# Altium schematic sheet FastDAC.SchDoc: Fast DAC
size Letter
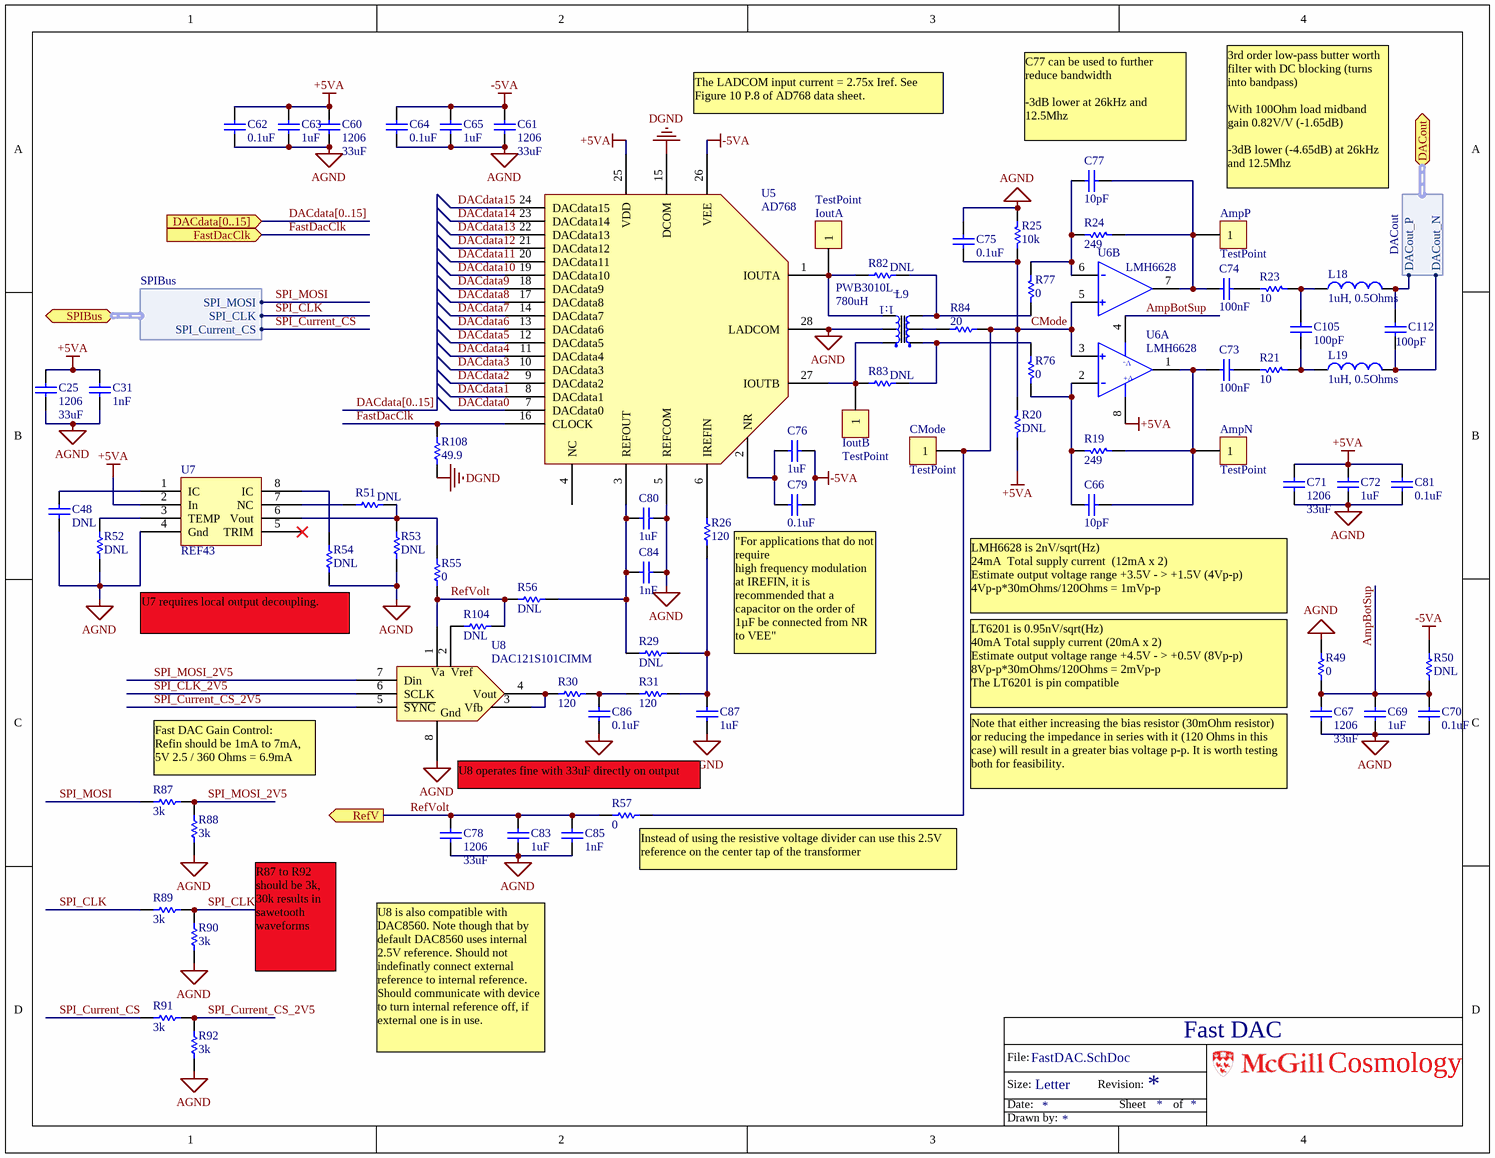
[diagram p0: FastDAC.SchDoc]

## Parts
AmpN  TestPoint  [TP-3520-SK]  (no BOM)
AmpP  TestPoint  [TP-3520-SK]  (no BOM)
C25  Footprint: 1206  [CC3225-1210]  (hidden comment: 33uF)
C31  1nF  [0603]
C48  DNL  [0603]
C60  Footprint: 1206  [CC3225-1210]  (hidden comment: 33uF)
C61  Footprint: 1206  [CC3225-1210]  (hidden comment: 33uF)
C62  0.1uF  [0603]
C63  1uF  [0603]
C64  0.1uF  [0603]
C65  1uF  [0603]
C66  10pF  [0603]
C67  Footprint: 1206  [CC3225-1210]  (hidden comment: 33uF)
C69  1uF  [0603]
C70  0.1uF  [0603]
C71  Footprint: 1206  [CC3225-1210]  (hidden comment: 33uF)
C72  1uF  [0603]
C73  100nF  [0603]
C74  100nF  [0603]
C75  0.1uF  [0603]
C76  1uF  [0603]
C77  10pF  [0603]
C78  Footprint: 1206  [CC3225-1210]  (hidden comment: 33uF)
C79  0.1uF  [0603]
C80  1uF  [0603]
C81  0.1uF  [0603]
C83  1uF  [0603]
C84  1nF  [0603]
C85  1nF  [0603]
C86  0.1uF  [0603]
C87  1uF  [0603]
C105  100pF  [0603]
C112  100pF  [0603]
CMode  TestPoint  [TP-3520-SK]  (no BOM)
IoutA  TestPoint  [TP-3520-SK]  (no BOM)
IoutB  TestPoint  [TP-3520-SK]  (no BOM)
L9  PWB3010L_  value 780uH  [PWB]
L18  1uH, 0.5Ohms  [0805]
L19  1uH, 0.5Ohms  [0805]
R19  249  [0603]
R20  DNL  [0603]
R21  10  [0603]
R23  10  [0603]
R24  249  [0603]
R25  10k  [0603]
R26  120  [0603]
R29  DNL  [0603]
R30  120  [0603]
R31  120  [0603]
R49  0  [0603]
R50  DNL  [0603]
R51  DNL  [0603]
R52  DNL  [0603]
R53  DNL  [0603]
R54  DNL  [0603]
R55  0  [0603]
R56  DNL  [0603]
R57  0  [0603]
R76  0  [0603]
R77  0  [0603]
R82  DNL  [0603]
R83  DNL  [0603]
R84  20  [0603]
R87  3k  [0603]
R88  3k  [0603]
R89  3k  [0603]
R90  3k  [0603]
R91  3k  [0603]
R92  3k  [0603]
R104  DNL  [0603]
R108  49.9  [0603]
U5  AD768  [SOIC 28 300mils]
U6  LMH6628  [SO8]  (parts A,B of 2)
U7  REF43  [SO8]
U8  DAC121S101CIMM  [MSOP-8]

## Ports
DACdata[0..15] (in), DACout (harness DACout), FastDacClk (in), RefV (out), SPIBus (harness SPIBus)

## Harnesses
DACout: DACout_N, DACout_P
SPIBus: SPI_MOSI, SPI_CLK, SPI_Current_CS

## Nets
+5VA: C25.1 C31.1 C60.2 C62.2 C63.2 C71.2 C72.1 C81.1 R20.2 U5.25(VDD) U6.8(V+) U7.2(In)
-5VA: C61.2 C64.2 C65.2 C76.1 C79.1 R50.2 U5.26(VEE)
AGND: C25.2 C31.2 C48.2 C60.1 C61.1 C62.1 C63.1 C64.1 C65.1 C67.1 C69.2 C70.2 C71.1 C72.2 C75.1 C78.2 C80.2 C81.2 C83.2 C84.2 C85.2 C86.2 C87.2 L9.2(PrimCent) R25.1 R49.2 R52.2 R53.1 R54.2 R88.2 R90.2 R92.2 U5.5(REFCOM) U5.28(LADCOM) U7.4(Gnd) U8.8(Gnd)
DGND: R108.1 U5.15(DCOM)
AmpBotSup: C67.2 C69.1 C70.1 R49.1 R50.1 U6.4(V-)
CMode: C75.2 CMode.1 R20.1 R25.2 R57.2 R84.2 U6.3(IN+) U6.5(IN+)
DACdata0: U5.7(DACdata0)
DACdata1: U5.8(DACdata1)
DACdata2: U5.9(DACdata2)
DACdata3: U5.10(DACdata3)
DACdata4: U5.11(DACdata4)
DACdata5: U5.12(DACdata5)
DACdata6: U5.13(DACdata6)
DACdata7: U5.14(DACdata7)
DACdata8: U5.17(DACdata8)
DACdata9: U5.18(DACdata9)
DACdata10: U5.19(DACdata10)
DACdata11: U5.20(DACdata11)
DACdata12: U5.21(DACdata12)
DACdata13: U5.22(DACdata13)
DACdata14: U5.23(DACdata14)
DACdata15: U5.24(DACdata15)
FastDacClk: R108.2 U5.16(CLOCK) ; port FastDacClk
RefVolt: C78.1 C83.1 C85.1 R55.2 R56.1 R57.1 R104.2 U8.1(Va) ; port RefV
SPI_CLK: R89.1 ; port SPIBus.SPI_CLK
SPI_CLK_2V5: R89.2 R90.1 U8.6(SCLK)
SPI_Current_CS: R91.1 ; port SPIBus.SPI_Current_CS
SPI_Current_CS_2V5: R91.2 R92.1 U8.5(~{SYNC})
SPI_MOSI: R87.1 ; port SPIBus.SPI_MOSI
SPI_MOSI_2V5: R87.2 R88.1 U8.7(Din)
NetAmpN_1: AmpN.1 C66.2 C73.2 R19.2 U6.1(Out)
NetAmpP_1: AmpP.1 C74.2 C77.2 R24.2 U6.7(Out)
NetC48_1: C48.1 U7.1(IC)
NetC66_1: C66.1 R19.1 R76.1 U6.2(IN-)
NetC73_1: C73.1 R21.1
NetC74_1: C74.1 R23.1
NetC76_2: C76.2 C79.2 U5.2(NR)
NetC77_1: C77.1 R24.1 R77.2 U6.6(IN-)
NetC80_1: C80.1 C84.1 R29.1 R56.2 U5.3(REFOUT)
NetC86_1: C86.1 R30.1 R31.2
NetC87_1: C87.1 R26.2 R29.2 R31.1
NetC105_1: C105.1 L18.1 R23.2
NetC105_2: C105.2 L19.1 R21.2
NetC112_1: C112.1 L18.2 ; port DACout.DACout_P
NetC112_2: C112.2 L19.2 ; port DACout.DACout_N
NetIoutA_1: IoutA.1 L9.3(Prim) R82.2 U5.1(IOUTA)
NetIoutB_1: IoutB.1 L9.1(PrimDot) R83.2 U5.27(IOUTB)
NetL9_4: L9.4(Sec) R77.1 R82.1
NetL9_5: L9.5(SecCent) R84.1
NetL9_6: L9.6(SecDot) R76.2 R83.1
NetR26_1: R26.1 U5.6(IREFIN)
NetR30_2: R30.2 U8.3(NC) U8.4(Vout)
NetR51_1: R51.1 R53.2 R55.1 U7.6(Vout)
NetR51_2: R51.2 U7.7(NC)
NetR52_1: R52.1 U7.3(TEMP)
NetR54_1: R54.1 U7.8(IC)
NetR104_1: R104.1 U8.2(NC)

Not connected (* = marked no-connect by the designer): U5 4(NC); U7 5(TRIM)*

## Buses and harness runs
bus DACdata[0..15]
bus DACdata[0..15] = port DACdata[0..15]

## Notes on the sheet
- The LADCOM input current = 2.75x Iref. See Figure 10 P.8 of AD768 data sheet.
- (near C77) C77 can be used to further reduce bandwidth
  -3dB lower at 26kHz and 12.5Mhz
- (near AmpP) 3rd order low-pass butter worth filter with DC blocking (turns into bandpass)
  With 100Ohm load midband gain 0.82V/V (-1.65dB)
  -3dB lower (-4.65dB) at 26kHz and 12.5Mhz
- (near R54) U7 requires local output decoupling.
- LMH6628 is 2nV/sqrt(Hz)
  24mA  Total supply current  (12mA x 2)
  Estimate output voltage range +3.5V - > +1.5V (4Vp-p)
  4Vp-p*30mOhms/120Ohms = 1mVp-p
- "For applications that do not require
  high frequency modulation at IREFIN, it is recommended that a capacitor on the order of 1µF be connected from NR to VEE"
- LT6201 is 0.95nV/sqrt(Hz)
  40mA Total supply current (20mA x 2)
  Estimate output voltage range +4.5V - > +0.5V (8Vp-p)
  8Vp-p*30mOhms/120Ohms = 2mVp-p
  The LT6201 is pin compatible
- Fast DAC Gain Control:
  Refin should be 1mA to 7mA, 5V 2.5 / 360 Ohms = 6.9mA
- U8 operates fine with 33uF directly on output
- Note that either increasing the bias resistor (30mOhm resistor) or reducing the impedance in series with it (120 Ohms in this case) will result in a greater bias voltage p-p. It is worth testing both for feasibility.
- (near R57) Instead of using the resistive voltage divider can use this 2.5V reference on the center tap of the transformer
- R87 to R92 should be 3k, 30k results in sawetooth waveforms
- U8 is also compatible with DAC8560. Note though that by default DAC8560 uses internal 2.5V reference. Should not indefinatly connect external reference to internal reference. Should communicate with device to turn internal reference off, if external one is in use.
- File:
- Size:
- Date:
- Letter
- Revision:
- Sheet
- of
- Cosmology
- Drawn by:
- (in symbol PWB-1-CLB) 1:1

## Library data of the parts
AmpN AmpP CMode IoutA IoutB = TestPoint: TestPoint1; Assembly Comments: none; Footprint: *; Type: Test Point; SupplierUnitCost: 0
C25 C60 C61 C67 C71 C78 = CAP 1210: Capacitor, Ceramic, 1210; Manufacturer: TDK Corporation; Part Constraints: 33uF or 47uF  (1206 or 1210) 25V X5R; Manufacturers Part Number: C3216X5R1E336M; Assembly Comments: none; Type: Capacitor; SupplierUnitCost: $1.1; Value: 33uF; Supplier 1: Digi-Key; Supplier Part Number 1: 445-8046-1-ND
C31 C48 C62 C64 C66 C70 C73-C75 C77 C79 C81 C84-C86 C105 C112 = CAP 0603: Capacitor, Ceramic, 0603; Part Constraints: 10% 16V X7R 0603; Manufacturer: Generic; Manufacturers Part Number: Generic; Type: Capacitor; SupplierUnitCost: 0
  C31 C84 C85: Value: 1nF
  C48: Value: DNL
  C62 C64 C70 C75 C79 C81 C86: Value: 0.1uF
  C66 C77: Value: 10pF
  C73 C74: Value: 100nF
  C105 C112: Value: 100pF
C63 C65 C69 C72 C76 C80 C83 C87 = CAP 0603: Capacitor, Ceramic, 0603; Part Constraints: 10% 16V X7R 0603; Manufacturer: Generic; Manufacturers Part Number: e.g C1608X7R1C105K; Value: 1uF; Type: Capacitor; SupplierUnitCost: $0.12
L9 = PWB-1-CLB: Transformer; Manufacturer: Coil Craft; Assembly Comments: none; Manufacturers Part Number: PWB3010L_; Part Constraints: PWB3010L_; Supplier 1: Coil Craft; Supplier Part Number 1: PWB3010L_; SupplierUnitCost: $3.25
L18 L19 = IND 0805: Inductor 0805; Manufacturer: EPCOS Inc; Manufacturers Part Number: B82498F1102J; Part Constraints: 1uH, 0.5Ohms DRC, 440Mhz SRF, Irms 0.24A, 5%; Assembly Comments: none; Type: Inductor; SupplierUnitCost: $1.06; Value: 1uH, 0.5Ohms; Supplier 1: Digi-Key; Supplier Part Number 1: 495-1844-1-ND
R19-R21 R23-R26 R29-R31 R49-R57 R76 R77 R82-R84 R104 R108 = RES 0603: Resistor; Manufacturer: Generic; Part Constraints: 1% 1/10W 100ppm 0603; Manufacturers Part Number: Generic; Type: Resistor; SupplierUnitCost: 0
  R19 R24: Value: 249
  R20 R29 R50-R54 R56 R82 R83 R104: Value: DNL
  R21 R23: Value: 10
  R25: Value: 10k
  R26 R30 R31: Value: 120
  R49 R55 R57 R76 R77: Value: 0
  R84: Value: 20
  R108: Value: 49.9
R87-R92 = RES 0603: Resistor; Manufacturer: Generic; Part Constraints: 1% 1/10W 100ppm 0603; Assembly Comments: none; Manufacturers Part Number: Generic; Type: Resistor; SupplierUnitCost: 0; Value: 3k
U5 = AD768: DAC 16bit 30MSPS; Manufacturers Part Number: AD768ARZ; Manufacturer: Analog Devices; Assembly Comments: none; Part Constraints: AD768ARZ; Supplier 1: Digi-Key; Supplier Part Number 1: AD768ARZ-ND; Type: IC; SupplierUnitCost: $46.27
U6 = LMH6628: Dual Opamp 200Mhz GBP Soic 8; Part Constraints: LMH6628MA/NOPB; Manufacturer: National Semiconductor; Assembly Comments: none; Manufacturers Part Number: LMH6628MA/NOPB; Type: IC; SupplierUnitCost: $4.44; Supplier 1: Digi-Key; Supplier Part Number 1: LMH6628MA-ND
U7 = REF43: Voltage Referance; Part Constraints: REF43GSZ; Manufacturer: Analog Devices; Assembly Comments: none; Manufacturers Part Number: REF43GSZ; SupplierUnitCost: $9.87; Supplier 1: Digi-Key; Supplier Part Number 1: REF43GSZ-ND
U8 = DAC121S101CIMM/NOPB: CONV D/A 12BIT MICROPWR 8MSOP; Manufacturer: National Semiconductor; Settling Time: 12µs; Number of Bits: 12; Data Interface: DSP, MICROWIRE™, QSPI™, Serial, SPI™; Number of Converters: 1; Voltage Supply Source: Single Supply; Power Dissipation (Max): 1.72mW; Number of Outputs and Type: 1 Voltage, Unipolar; 1 Voltage, Bipolar; Assembly Comments: none; RoHS: RoHS Compliant; Category: Integrated Circuits (ICs); Stock 1: 3011; Pricing 1: 1=3.5, 25=2.8616, 100=2.5698, 250=2.33624, 500=2.0442 (CAD); Operating Temperature: -40°C ~ 105°C; Mounting Type: Surface Mount; Package / Case: 8-TSSOP, 8-MSOP (0.118", 3.00mm Width); Supplier Device Package: 8-MSOP; Packaging: Cut Tape (CT); Sampling Rate (Per Second): *; ComponentLink1URL: http://www.ti.com/lit/ds/symlink/dac121s101.pdf; ComponentLink1Description: http://www.ti.com/lit/ds/symlink/dac121s101.pdf; Supplier 1: Digi-Key; Supplier Part Number 1: DAC121S101CIMMCT-ND; Part Constraints: DAC121S101CIMM/NOPB; Manufacturers Part Number: DAC121S101CIMM/NOPB; Type: IC; SupplierUnitCost: $3.70